# EAGLE design esp8266 (EAGLE 9.6.2)
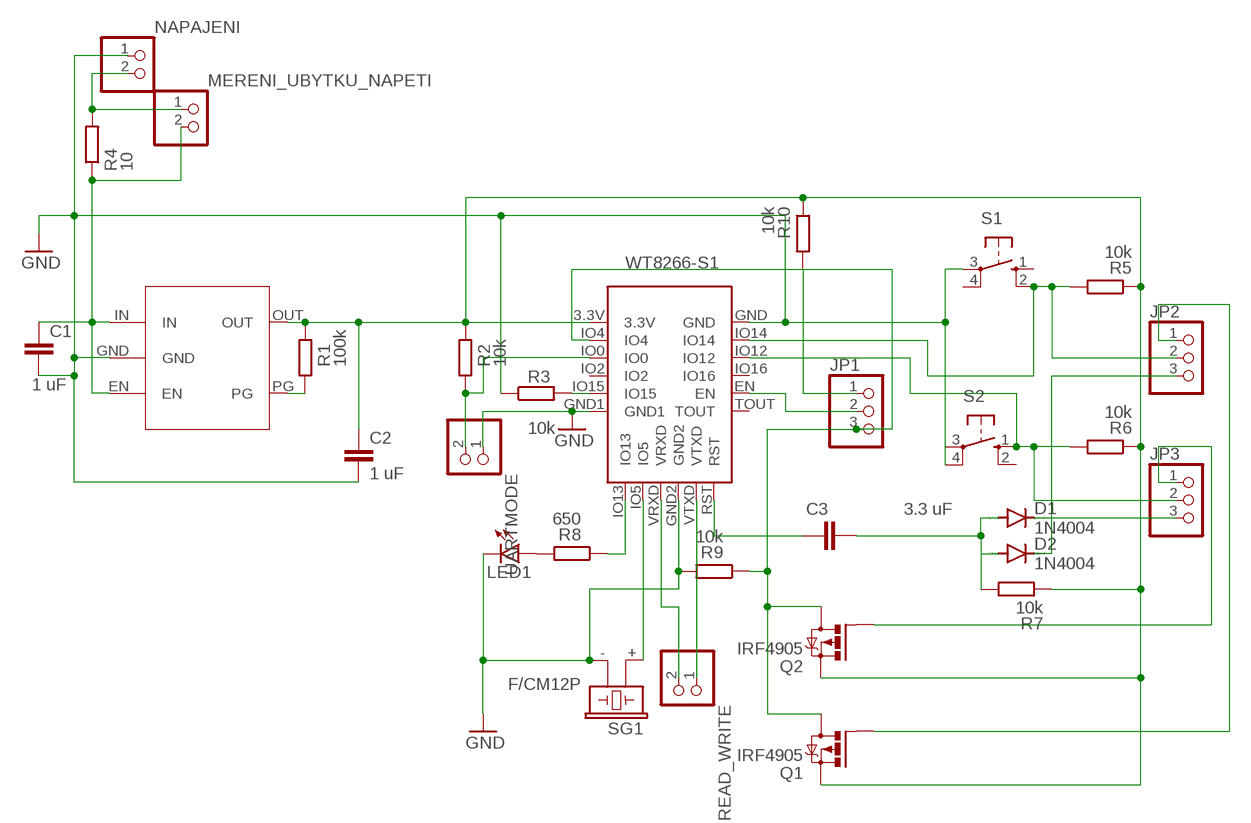
[diagram p0: schematic, sheet 1]

## Parts
C1  1 uF  C2.5/2  [C2.5-2]
C2  1 uF  C2.5/2  [C2.5-2]
C3  3.3 uF  C2.5/2  [C2.5-2]
D1  1N4004  [DO41-10]
D2  1N4004  [DO41-10]
JP1  PINHD-1X3  [1X03]
JP2  PINHD-1X3  [1X03]
JP3  PINHD-1X3  [1X03]
LED1  LED5MM  [LED5MM]
MERENI_UBYTKU_NAPETI  PINHD-1X2  [1X02]
NAPAJENI  PINHD-1X2  [1X02]
Q1  IRF4905  [TO220BH]
Q2  IRF4905  [TO220BH]
R1  100k  R-EU_0207/10  [0207/10]
R2  10k  R-EU_0207/10  [0207/10]
R3  10k  R-EU_0207/10  [0207/10]
R4  10  R-EU_0207/10  [0207/10]
R5  10k  R-EU_0207/10  [0207/10]
R6  10k  R-EU_0207/10  [0207/10]
R7  10k  R-EU_0207/10  [0207/10]
R8  650  R-EU_0207/10  [0207/10]
R9  10k  R-EU_0207/10  [0207/10]
R10  10k  R-EU_0207/10  [0207/10]
READ_WRITE  PINHD-1X2  [1X02]
S1  10-XX  [B3F-10XX]
S2  10-XX  [B3F-10XX]
SG1  F/CM12P  [F/CM12P]
U$1  WT8266-S1  [WT8266-S1]
U$2  LDLN030  [LDLN030]
UARTMODE  PINHD-1X2  [1X02]

## Nets
GND: C1.2 C2.2 LED1.K(C) NAPAJENI.1 R3.1 R9.2 S1.3(P) S2.4(P1) SG1.- U$1.GND U$1.GND1 U$1.GND2 U$2.GND UARTMODE.1
N$1: C1.1 MERENI_UBYTKU_NAPETI.2 R4.1 U$2.EN U$2.IN
N$2: D2.C JP2.3
N$3: R2.1 U$1.IO0 UARTMODE.2
N$4: R1.1 U$2.PG
N$5: READ_WRITE.2 U$1.VRXD
N$6: C2.1 Q1.S Q2.S R1.2 R2.2 R5.1 R6.1 R7.1 R10.1 U$1.3.3V U$2.OUT
N$7: READ_WRITE.1 U$1.VTXD
N$9: R3.2 U$1.IO15
N$10: MERENI_UBYTKU_NAPETI.1 NAPAJENI.2 R4.2
N$11: C3.1 U$1.RST
N$12: JP3.2 R6.2 S2.1(S) U$1.IO12
N$13: JP2.2 R5.2 S1.2(S1) U$1.IO14
N$14: C3.2 D1.A D2.A R7.2
N$15: R8.1 U$1.IO13
N$16: LED1.A R8.2
N$17: SG1.+ U$1.IO5
N$18: JP1.3 Q1.D Q2.D R9.1 U$1.IO4
N$19: JP1.2 U$1.EN
N$20: JP1.1 R10.2
N$21: D1.C JP3.3
N$22: JP3.1 Q2.G
N$23: JP2.1 Q1.G
Unconnected: S1.1(S) S1.4(P1) S2.2(S1) S2.3(P) U$1.IO2 U$1.IO16 U$1.TOUT

## Library data of the parts
C1-C3 = capacitor-wima:C: CAPACITOR naming: grid - package width
D1 D2 = diode:1N4004: DIODE general purpose rectifier, 1 A
JP1-JP3 = pinhead:PINHD-1X3: PIN HEADER
LED1 = led:LED: LED OSRAM: - CHIPLED LG R971, LG N971, LY N971, LG Q971, LY Q971, LO R971, LY R971 LH N974, LH R974 LS Q976, LO Q976, LY Q976 LO Q996 - Hyper CHIPLED LW Q18S LB Q993, LB Q99A, LB R99A - SideLED LS A670, LO A670, LY A670, LG A670, LP A670 LB A673, LV A673, LT A673, LW A673 LH A674 LY A675 LS A676, LA A676, LO A676, LY A676, LW A676 LS A679, LY A679, LG A679 - Hyper Micro SIDELED® LS Y876, LA Y876, LO Y876, LY Y876 LT Y87S - SmartLED LW L88C, LW L88S LB L89C, LB L89S, LG L890 LS L89K, LO L89K, LY L89K LS L896, LA L896, LO L896, LY L896 - TOPLED LS T670, LO T670, LY T670, LG T670, LP T670 LSG T670, LSP T670, LSY T670, LOP T670, LYG T670 LG T671, LOG T671, LSG T671 LB T673, LV T673, LT T673, LW T673 LH T674 LS T676, LA T676, LO T676, LY T676, LB T676, LH T676, LSB T676, LW T676 LB T67C, LV T67C, LT T67C, LS T67K, LO T67K, LY T67K, LW E67C LS E67B, LA E67B, LO E67B, LY E67B, LB E67C, LV E67C, LT E67C LW T67C LS T679, LY T679, LG T679 LS T770, LO T770, LY T770, LG T770, LP T770 LB T773, LV T773, LT T773, LW T773 LH T774 LS E675, LA E675, LY E675, LS T675 LS T776, LA T776, LO T776, LY T776, LB T776 LHGB T686 LT T68C, LB T68C - Hyper Mini TOPLED® LB M676 - Mini TOPLED Santana® LG M470 LS M47K, LO M47K, LY M47K Source: http://www.osram.convergy.de LUXEON: - LUMILED® LXK2-PW12-R00, LXK2-PW12-S00, LXK2-PW14-U00, LXK2-PW14-V00 LXK2-PM12-R00, LXK2-PM12-S00, LXK2-PM14-U00 LXK2-PE12-Q00, LXK2-PE12-R00, LXK2-PE12-S00, LXK2-PE14-T00, LXK2-PE14-U00 LXK2-PB12-K00, LXK2-PB12-L00, LXK2-PB12-M00, LXK2-PB14-N00, LXK2-PB14-P00, LXK2-PB14-Q00 LXK2-PR12-L00, LXK2-PR12-M00, LXK2-PR14-Q00, LXK2-PR14-R00 LXK2-PD12-Q00, LXK2-PD12-R00, LXK2-PD12-S00 LXK2-PH12-R00, LXK2-PH12-S00 LXK2-PL12-P00, LXK2-PL12-Q00, LXK2-PL12-R00 Source: www.luxeon.com KINGBRIGHT: KA-3528ASYC Source: www.kingbright.com
MERENI_UBYTKU_NAPETI NAPAJENI READ_WRITE UARTMODE = pinhead:PINHD-1X2: PIN HEADER
Q1 Q2 = transistor-power:IRF4905: P-Channel HEXFET® Power MOSFET RDS(on)= 0.02 Ohm, ID = -74A Source: http://www.irf.com/product-info/datasheets/data/irf4905pbf.pdf
R1-R10 = rcl:R-EU_: RESISTOR, European symbol; SPICEPREFIX: R
S1 S2 = switch-omron:10-XX: OMRON SWITCH; MPN: B3F-1000; OC_FARNELL: 176432; OC_NEWARK: 36M3542
SG1 = buzzer:F/CM12P: BUZZER Source: Buerklin; OC_FARNELL: unknown; OC_NEWARK: unknown
U$1 = WT8266:WT8266-S1
U$2 = WT8266:LDLN030

## Board
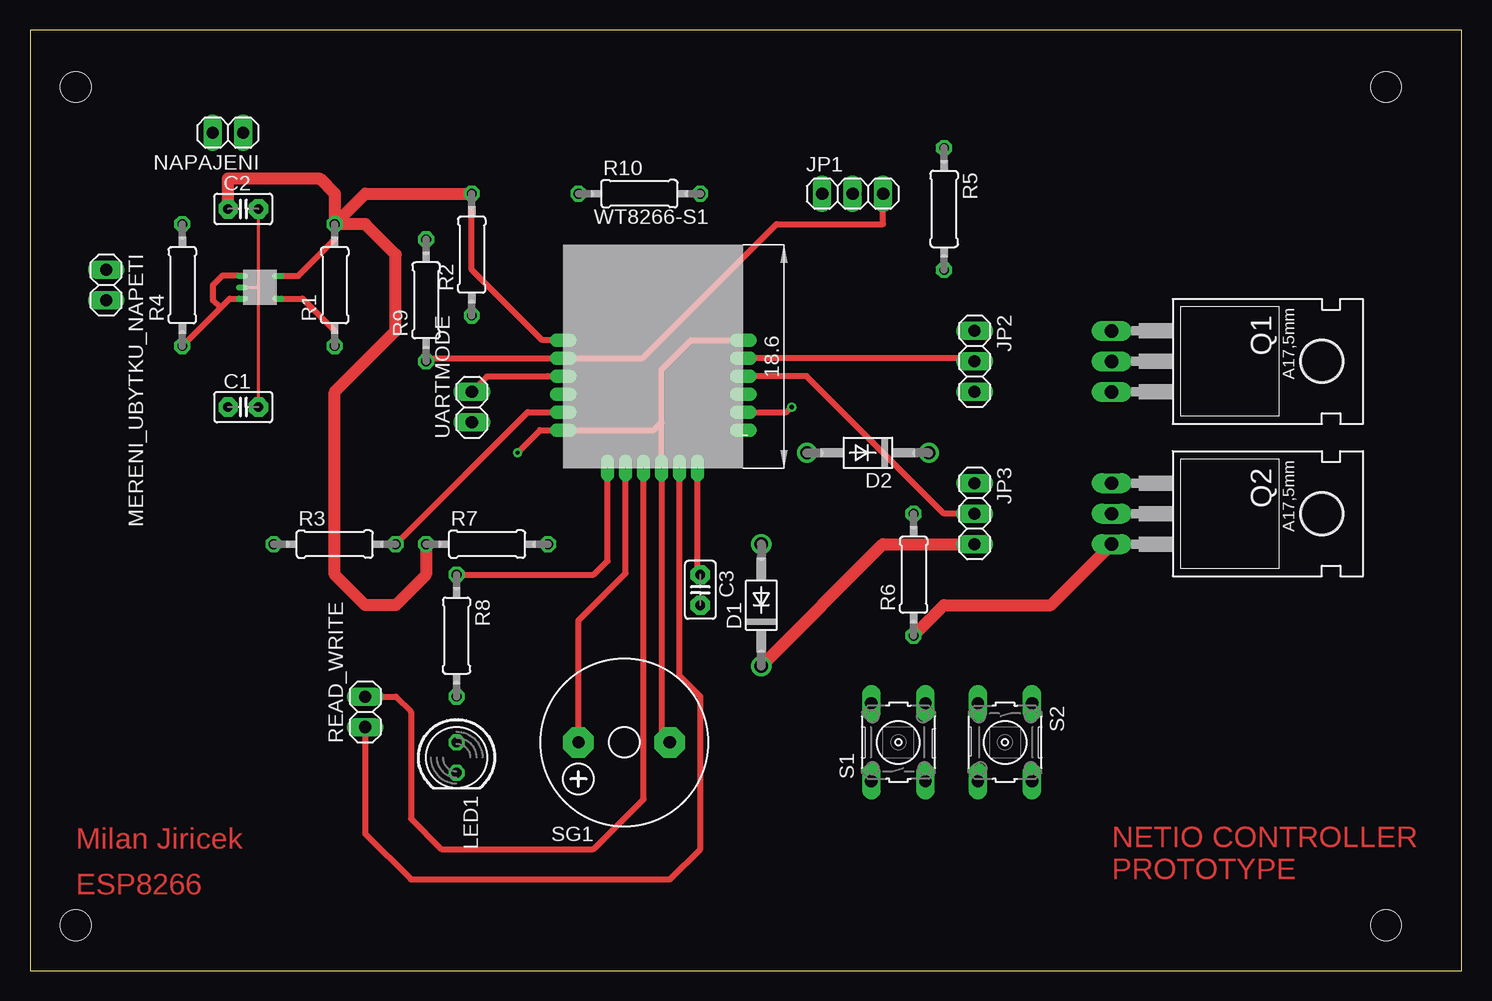
[diagram p1: board, top side]
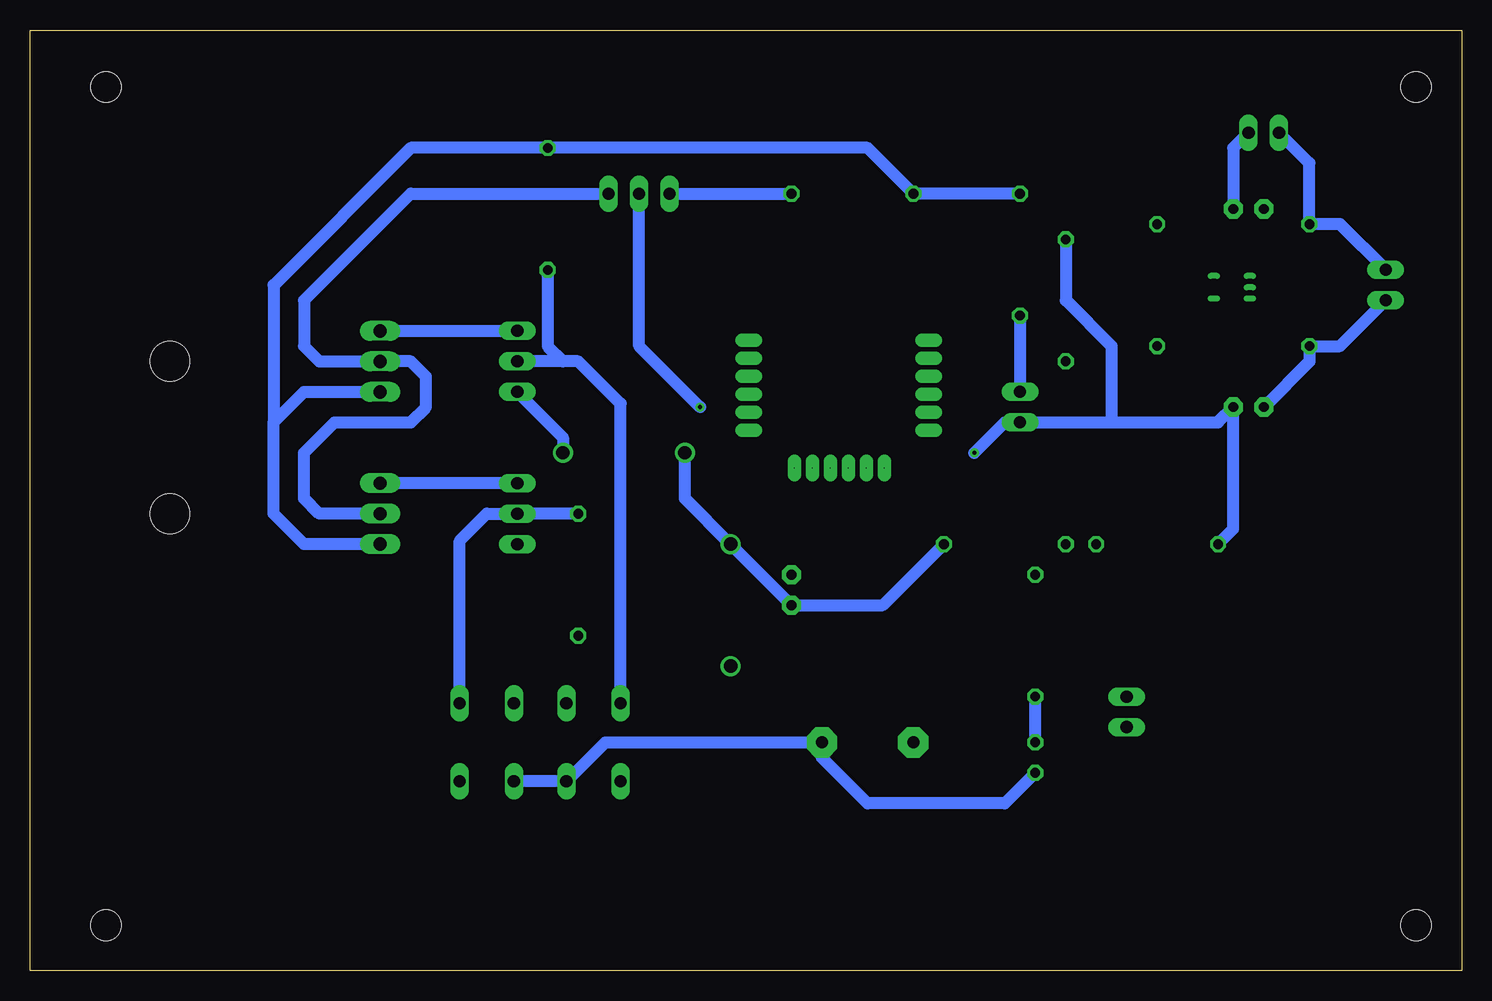
[diagram p2: board, bottom side, seen from below]

Size 119.36 x 78.41 mm. Coordinates in mm from the lower left corner, seen from the top.
Outline: 0,0 119.36,0 119.36,78.41 0,78.41 0,0
Copper layers (1*16): Top 0.035mm / dielectric 1.5mm / Bottom 0.035mm
Design rules "default": minimum track width 6mil, minimum drill 0.35mm, track to track 6mil, track to pad 6mil, pad to pad 6mil, via to via 6mil, smd to smd 6mil, copper to edge 40mil, drill to drill 6mil, minimum pad ring 10mil, minimum via ring 8mil, stop-mask expansion 4mil, vias tented up to drill 0mil, thermal gap 10mil
Holes 2.54 mm at 3.81,73.66 3.81,3.81 113.03,3.81 113.03,73.66

### Footprints (pad centres in the part's own frame; a part is rotated, then mirrored left to right if it is on the bottom)
C2.5-2 = drill 0.813 pad 1.6 octagon: 1 -1.27,0; 2 1.27,0
DO41-10 = drill 1.118: A 5.08,0; C -5.08,0
1X03 = drill 1.016 long: 1 -2.54,0; 2 0,0; 3 2.54,0
LED5MM = drill 0.813 octagon: A -1.27,0; K 1.27,0
1X02 = drill 1.016 long: 1 -1.27,0; 2 1.27,0
TO220BH = drill 1.118 long: D 0,-6.35; G -2.54,-6.35; S 2.54,-6.35 | hole 3.302: 0,11.176
0207/10 = drill 0.813 octagon: 1 -5.08,0; 2 5.08,0
B3F-10XX = drill 1.016 long: 1 -3.251,2.261; 2 3.251,2.261; 3 -3.251,-2.261; 4 3.251,-2.261
F/CM12P = drill 1.016 pad 2.54 octagon: + 3.81,0; - -3.81,0
WT8266-S1 = drill 0.01 pad 1.143 long: 3.3V 0,10.65; EN 15,4.65; GND 15,10.65; GND1 0,3.15; GND2 8.2,0; IO0 0,7.65; IO2 0,6.15; IO4 0,9.15; IO5 5.2,0; IO12 15,7.65; IO13 3.7,0; IO14 15,9.15; IO15 0,4.65; IO16 15,6.15; RST 11.2,0; TOUT 15,3.15; VRXD 6.7,0; VTXD 9.7,0
LDLN030 = drill 0.01 pad 0.406 long: EN 2.4,-0.1; GND 1.45,-0.1; IN 0.5,-0.1; OUT 0.5,2.9; PG 2.4,2.9

### Placement (x,y rotation side)
C1  17.78,46.99 0 top
C2  17.78,63.5 0 top
C3  55.88,31.75 270 top
D1  60.96,30.48 90 top
D2  69.85,43.18 180 top
JP1  68.58,64.77 0 top
JP2  78.74,50.8 270 top
JP3  78.74,38.1 270 top
LED1  35.56,17.78 270 top
MERENI_UBYTKU_NAPETI  6.35,57.15 270 top
NAPAJENI  16.51,69.85 180 top
Q1  96.52,50.8 270 top
Q2  96.52,38.1 270 top
R1  25.4,57.15 90 top
R2  36.83,59.69 90 top
R3  25.4,35.56 0 top
R4  12.7,57.15 90 top
R5  76.2,63.5 270 top
R6  73.66,33.02 90 top
R7  38.1,35.56 0 top
R8  35.56,27.94 270 top
R9  33.02,55.88 90 top
R10  50.8,64.77 0 top
READ_WRITE  27.94,21.59 90 top
S1  72.39,19.05 90 top
S2  81.28,19.05 270 top
SG1  49.53,19.05 180 top
U$1  44.45,41.91 0 top
U$2  17.78,58.42 270 top
UARTMODE  36.83,46.99 90 top

### Tracks (layer width: path | path; a pad name or v marks a point on that pad's centre or on a via)
GND  (via drill 0.35)
  Top 0.254: C1.2 19.05,57.15 | 19.05,57.15 C2.2 | U$2.GND 18.87,56.97 19.05,57.15
  Top 0.508: SG1.- 52.65,19.74 U$1.GND2 52.65,45.72 | 52.65,45.72 52.65,50.11 55.1,52.56 U$1.GND | 52.65,45.72 51.99,45.06 U$1.GND1 42.52,45.06 v40.64,43.18
  Bottom 1.016: S2.4 S1.3 71.4,19.05 SG1.- 53.34,17.78 49.53,13.97 38.1,13.97 LED1.K | NAPAJENI.1 19.05,68.58 C2.2 | 29.21,45.72 UARTMODE.1 38.1,45.72 v40.64,43.18 | 29.21,45.72 20.32,45.72 C1.2 19.05,36.83 R3.1 | R9.2 33.02,55.88 29.21,52.07 29.21,45.72
N$1
  Top 0.508: R4.1 15.88,55.24 | 15.88,55.24 16.65,56.02 U$2.EN | U$2.IN 16.01,57.92 15.24,57.15 15.24,55.88 15.88,55.24
  Bottom 1.016: MERENI_UBYTKU_NAPETI.2 10.16,52.07 R4.1 12.7,50.8 C1.1
N$2
  Bottom 1.016: JP2.3 74.93,44.45 D2.C
N$3
  Top 0.508: UARTMODE.2 38.1,49.53 43.15,49.53 43.18,49.56 U$1.IO0
  Bottom 1.016: R2.1 UARTMODE.2
N$4
  Top 0.508: U$2.PG 22.72,56.02 25.4,53.34 R1.1
N$5
  Top 0.508: READ_WRITE.2 30.48,22.86 31.75,21.59 31.75,12.7 34.29,10.16 46.99,10.16 51.15,14.32 U$1.VRXD
N$6
  Top 0.508: U$2.OUT 22.36,57.92 25.4,60.96 R1.2 | U$1.3.3V 42.69,52.56 36.83,58.42 R2.2
  Top 1.016: Q2.S 85.09,30.48 76.2,30.48 R6.1 | C2.1 16.51,66.04 24.13,66.04 25.4,64.77 R1.2 | R7.1 33.02,33.02 30.48,30.48 27.94,30.48 25.4,33.02 25.4,48.26 30.48,53.34 30.48,59.69 27.94,62.23 R1.2 | R1.2 27.94,64.77 R2.2
  Bottom 1.016: Q2.S 96.52,35.56 99.06,38.1 99.06,45.72 | 99.06,45.72 96.52,48.26 Q1.S | R2.2 R10.1 49.53,68.58 R5.1 87.63,68.58 99.06,57.15 99.06,45.72
N$7
  Top 0.508: READ_WRITE.1 27.94,11.43 31.75,7.62 53.34,7.62 55.88,10.16 55.88,22.86 54.15,24.59 U$1.VTXD
N$9
  Top 0.508: R3.2 41.48,46.56 U$1.IO15
N$10
  Bottom 1.016: MERENI_UBYTKU_NAPETI.1 10.16,62.23 R4.2 12.7,67.31 NAPAJENI.2
N$11
  Top 0.508: C3.1 55.65,33.25 U$1.RST
N$12
  Top 0.508: U$1.IO12 64.74,49.56 76.2,38.1 JP3.2
  Bottom 1.016: S2.1 83.54,35.84 81.28,38.1 JP3.2 R6.2
N$13
  Top 0.508: JP2.2 78.48,51.06 U$1.IO14
  Bottom 1.016: S1.2 70.13,47.27 73.66,50.8 74.93,50.8 | 74.93,50.8 JP2.2 | R5.2 76.2,52.07 74.93,50.8
N$14
  Bottom 1.016: D2.A 64.77,39.37 D1.A C3.2 48.26,30.48 R7.2
N$15
  Top 0.508: R8.1 46.99,33.02 48.15,34.18 U$1.IO13
N$16
  Bottom 1.016: LED1.A R8.2
N$17
  Top 0.508: SG1.+ 45.72,29.21 49.65,33.14 U$1.IO5
N$18
  Top 0.508: JP1.3 71.12,62.23 62.23,62.23 51.06,51.06 U$1.IO4 33.28,51.06 R9.1
  Bottom 1.016: Q2.D 95.25,38.1 96.52,39.37 96.52,43.18 93.98,45.72 87.63,45.72 86.36,46.99 86.36,49.53 87.63,50.8 Q1.D 95.25,50.8 96.52,52.07 96.52,55.88 87.63,64.77 JP1.3
N$19  (via drill 0.35)
  Top 0.508: U$1.EN 63.07,46.56 v63.5,46.99
  Bottom 1.016: v63.5,46.99 68.58,52.07 JP1.2
N$20
  Bottom 1.016: JP1.1 R10.2
N$21
  Top 1.016: D1.C 71.12,35.56 JP3.3
N$22
  Bottom 1.016: JP3.1 Q2.G
N$23
  Bottom 1.016: Q1.G JP2.1

### Text on the board
Top: Milan Jiricek | NETIO CONTROLLER / PROTOTYPE | ESP8266